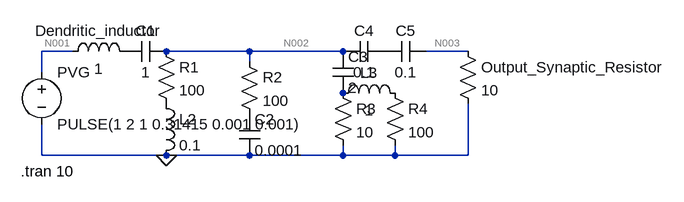
[diagram p0: schematic Neural pulse circuit schematic-approx2-1109.asc]
Neural pulse circuit schematic-approx2-1109.asc, the LTspice schematic file:
Version 4
SHEET 1 1036 680
WIRE 64 112 16 112
WIRE 336 112 208 112
WIRE 480 112 336 112
WIRE 672 112 608 112
WIRE 336 128 336 112
WIRE 16 144 16 112
WIRE 16 272 16 224
WIRE 208 272 16 272
WIRE 336 272 208 272
WIRE 480 272 480 256
WIRE 480 272 336 272
WIRE 560 272 560 256
WIRE 560 272 480 272
WIRE 672 272 672 192
WIRE 672 272 560 272
FLAG 208 272 0
SYMBOL voltage 16 128 R0
WINDOW 123 0 0 Left 2
WINDOW 39 0 0 Left 2
SYMATTR InstName PVG
SYMATTR Value PULSE(1 2 1 0.31415 0.001 0.001)
SYMBOL ind 48 128 R270
WINDOW 0 32 56 VTop 2
WINDOW 3 5 56 VBottom 2
SYMATTR InstName Dendritic_inductor
SYMATTR Value 1
SYMBOL cap 208 96 R90
WINDOW 0 0 32 VBottom 2
WINDOW 3 32 32 VTop 2
SYMATTR InstName C1
SYMATTR Value 1
SYMBOL res 192 96 R0
SYMATTR InstName R1
SYMATTR Value 100
SYMBOL ind 192 176 R0
SYMATTR InstName L2
SYMATTR Value 0.1
SYMBOL cap 320 208 R0
SYMATTR InstName C2
SYMATTR Value 0.0001
SYMBOL res 320 112 R0
SYMATTR InstName R2
SYMATTR Value 100
SYMBOL cap 464 112 R0
SYMATTR InstName C3
SYMATTR Value 2
SYMBOL ind 464 192 R270
WINDOW 0 32 56 VTop 2
WINDOW 3 5 56 VBottom 2
SYMATTR InstName L3
SYMATTR Value 1
SYMBOL res 464 160 R0
SYMATTR InstName R3
SYMATTR Value 10
SYMBOL res 544 160 R0
SYMATTR InstName R4
SYMATTR Value 100
SYMBOL cap 544 96 R90
WINDOW 0 0 32 VBottom 2
WINDOW 3 32 32 VTop 2
SYMATTR InstName C4
SYMATTR Value 0.1
SYMBOL cap 608 96 R90
WINDOW 0 0 32 VBottom 2
WINDOW 3 32 32 VTop 2
SYMATTR InstName C5
SYMATTR Value 0.1
SYMBOL res 656 96 R0
SYMATTR InstName Output_Synaptic_Resistor
SYMATTR Value 10
TEXT -16 296 Left 2 !.tran 10

The netlist it stands for:
* Neural pulse circuit schematic-approx2-1109.asc
V§PVG N001 0 PULSE(1 2 1 0.31415 0.001 0.001)
L§Dendritic_inductor N001 P001 1
C1 N002 P001 1
R1 N002 P002 100
L2 P002 0 0.1
C2 P003 0 0.0001
R2 N002 P003 100
C3 N002 P004 2
L3 P004 P005 1
R3 P004 0 10
R4 P005 0 100
C4 P006 N002 0.1
C5 N003 P006 0.1
R§Output_Synaptic_Resistor N003 0 10
.tran 10
.backanno
.end

* Results of the author's LTspice run, read from the files saved beside the schematic
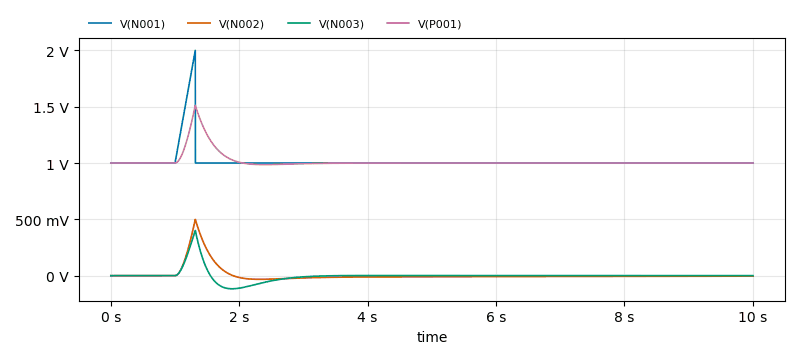
[diagram p1: Transient Analysis of Neural pulse circuit schematic-approx2-1109.asc, plotted from the saved traces]
* Transient Analysis, 1 run:
*   V(N001): min 1 V, max 2 V, average 1.016 V, rms 1.021 V, last 1 V
*   V(N002): min -32.59 mV, max 499.6 mV, average 7.101 mV, rms 69.11 mV, last -4.23 mV
*   V(N003): min -116.6 mV, max 401.3 mV, average -224.8 µV, rms 54.84 mV, last 376.3 µV
*   V(P001): min 985.6 mV, max 1.511 V, average 1.016 V, rms 1.018 V, last 999.9 mV